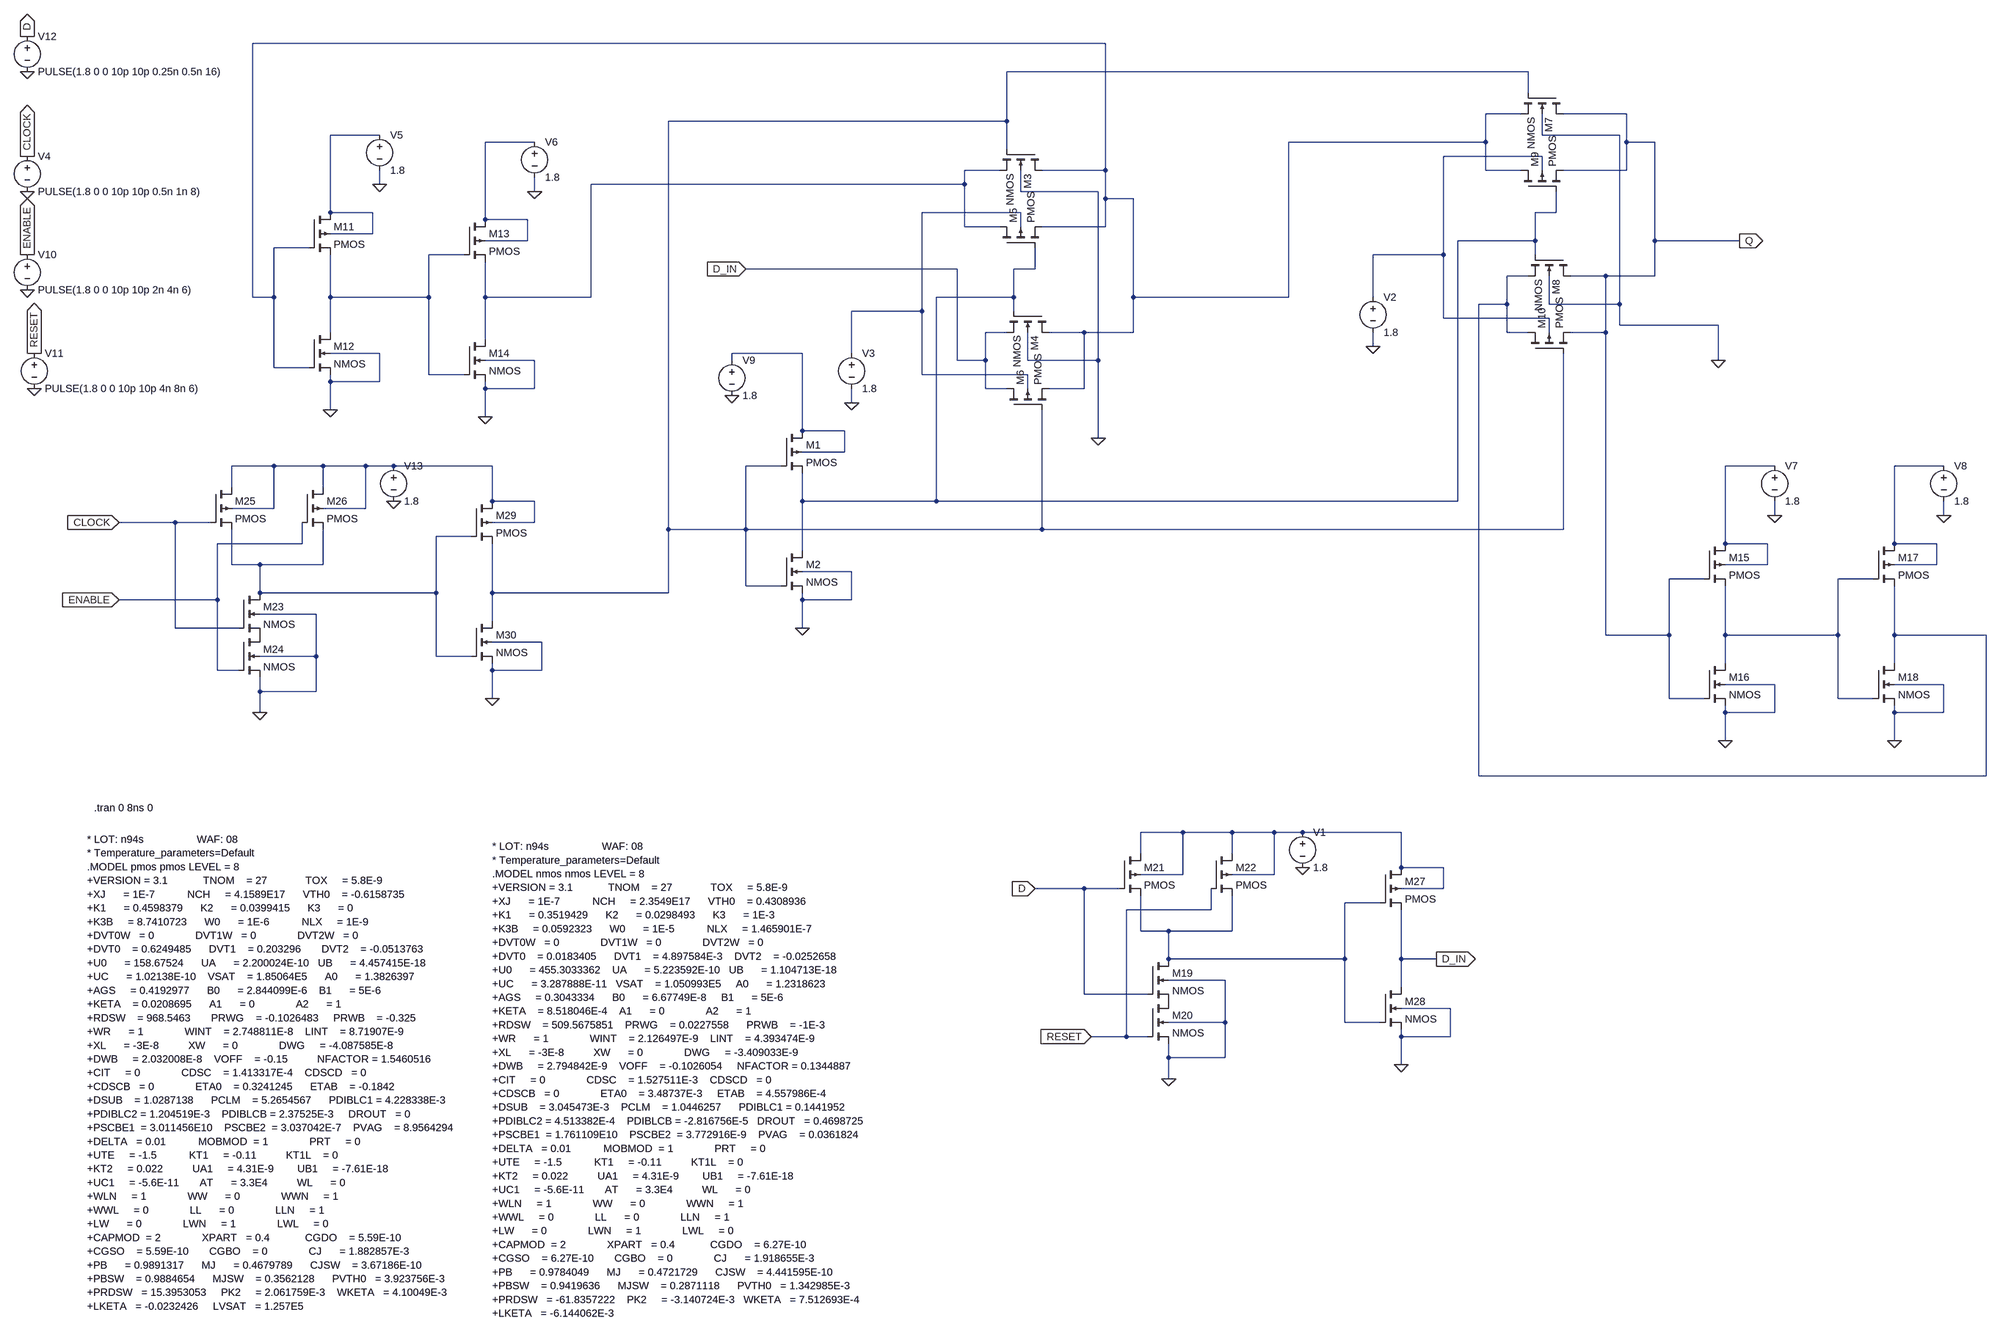
[diagram p0: schematic DFF_With_Cntrs_2.asc]
DFF_With_Cntrs_2.asc, the LTspice schematic file:
Version 4
SHEET 1 2416 1836
WIRE -240 -752 -2176 -752
WIRE 720 -688 -464 -688
WIRE 720 -640 720 -688
WIRE 704 -592 624 -592
WIRE 944 -592 800 -592
WIRE -464 -576 -464 -688
WIRE -464 -576 -1232 -576
WIRE -1888 -544 -2000 -544
WIRE 752 -544 752 -592
WIRE 928 -544 752 -544
WIRE -1536 -528 -1648 -528
WIRE 624 -528 624 -592
WIRE 624 -528 176 -528
WIRE 944 -528 944 -592
WIRE 1008 -528 944 -528
WIRE -464 -512 -464 -576
WIRE 752 -496 528 -496
WIRE -480 -464 -560 -464
WIRE -240 -464 -240 -752
WIRE -240 -464 -384 -464
WIRE 624 -464 624 -528
WIRE 704 -464 624 -464
WIRE 752 -464 752 -496
WIRE 944 -464 944 -528
WIRE 944 -464 800 -464
WIRE -1888 -432 -1888 -464
WIRE -560 -432 -560 -464
WIRE -560 -432 -1408 -432
WIRE -1536 -416 -1536 -448
WIRE -432 -416 -432 -464
WIRE -256 -416 -432 -416
WIRE -240 -400 -240 -464
WIRE -176 -400 -240 -400
WIRE -2000 -368 -2000 -544
WIRE -1904 -368 -2000 -368
WIRE -432 -368 -656 -368
WIRE 784 -368 784 -416
WIRE 784 -368 736 -368
WIRE -1648 -352 -1648 -528
WIRE -1552 -352 -1648 -352
WIRE -560 -336 -560 -432
WIRE -480 -336 -560 -336
WIRE -432 -336 -432 -368
WIRE -240 -336 -240 -400
WIRE -240 -336 -384 -336
WIRE -1904 -320 -1904 -368
WIRE -1904 -320 -2000 -320
WIRE -1552 -304 -1552 -352
WIRE -1552 -304 -1648 -304
WIRE 736 -304 736 -368
WIRE 736 -304 560 -304
WIRE 1008 -304 1008 -528
WIRE 1200 -304 1008 -304
WIRE -2048 -288 -2128 -288
WIRE -1696 -272 -1776 -272
WIRE 528 -272 528 -496
WIRE 528 -272 368 -272
WIRE 736 -272 736 -304
WIRE -576 -240 -1056 -240
WIRE -400 -240 -400 -288
WIRE -400 -240 -448 -240
WIRE 720 -224 672 -224
WIRE 896 -224 816 -224
WIRE 1008 -224 1008 -304
WIRE 1008 -224 896 -224
WIRE -2176 -176 -2176 -752
WIRE -2128 -176 -2128 -288
WIRE -2128 -176 -2176 -176
WIRE -2000 -176 -2000 -272
WIRE -1776 -176 -1776 -272
WIRE -1776 -176 -2000 -176
WIRE -1648 -176 -1648 -256
WIRE -1408 -176 -1408 -432
WIRE -1408 -176 -1648 -176
WIRE -448 -176 -448 -240
WIRE -448 -176 -624 -176
WIRE -176 -176 -176 -400
WIRE 176 -176 176 -528
WIRE 176 -176 -176 -176
WIRE 368 -176 368 -272
WIRE 672 -160 672 -224
WIRE 672 -160 608 -160
WIRE 768 -160 768 -224
WIRE 928 -160 928 -544
WIRE 928 -160 768 -160
WIRE -656 -144 -656 -368
WIRE -656 -144 -816 -144
WIRE -448 -144 -448 -176
WIRE 528 -128 528 -272
WIRE 768 -128 528 -128
WIRE 928 -112 928 -160
WIRE 1152 -112 928 -112
WIRE -2000 -96 -2000 -176
WIRE -464 -96 -512 -96
WIRE -288 -96 -368 -96
WIRE -176 -96 -176 -176
WIRE -176 -96 -288 -96
WIRE 672 -96 672 -160
WIRE 720 -96 672 -96
WIRE 768 -96 768 -128
WIRE 896 -96 896 -224
WIRE 896 -96 816 -96
WIRE -1648 -80 -1648 -176
WIRE 368 -64 368 -96
WIRE -1888 -48 -2000 -48
WIRE -928 -48 -1088 -48
WIRE -816 -48 -816 -144
WIRE -1536 -32 -1648 -32
WIRE -1088 -32 -1088 -48
WIRE -576 -32 -576 -240
WIRE -512 -32 -512 -96
WIRE -512 -32 -576 -32
WIRE -416 -32 -416 -96
WIRE -256 -32 -256 -416
WIRE -256 -32 -416 -32
WIRE 1152 -32 1152 -112
WIRE -2128 -16 -2128 -176
WIRE -2048 -16 -2128 -16
WIRE -1776 0 -1776 -176
WIRE -1696 0 -1776 0
WIRE -656 0 -656 -144
WIRE -416 0 -656 0
WIRE -2000 16 -2000 0
WIRE -1888 16 -1888 -48
WIRE -1888 16 -2000 16
WIRE -1648 32 -1648 16
WIRE -1536 32 -1536 -32
WIRE -1536 32 -1648 32
WIRE -512 32 -512 -32
WIRE -464 32 -512 32
WIRE -416 32 -416 0
WIRE -288 32 -288 -96
WIRE -288 32 -368 32
WIRE -816 64 -816 32
WIRE -2000 80 -2000 16
WIRE -1648 96 -1648 32
WIRE -928 128 -928 -48
WIRE -832 128 -928 128
WIRE -256 144 -256 -32
WIRE -832 176 -832 128
WIRE -832 176 -928 176
WIRE -2128 208 -2224 208
WIRE -2016 208 -2128 208
WIRE -1920 208 -2016 208
WIRE -1856 208 -1920 208
WIRE -1632 208 -1856 208
WIRE -976 208 -1056 208
WIRE 1280 208 1168 208
WIRE 1664 208 1552 208
WIRE -2224 256 -2224 208
WIRE -2016 256 -2016 208
WIRE -1632 288 -1632 208
WIRE -1536 288 -1632 288
WIRE -928 288 -928 224
WIRE -624 288 -624 -176
WIRE -624 288 -928 288
WIRE 560 288 560 -304
WIRE 560 288 -624 288
WIRE -2128 304 -2128 208
WIRE -2128 304 -2224 304
WIRE -1920 304 -1920 208
WIRE -1920 304 -2016 304
WIRE 1280 320 1280 288
WIRE 1664 320 1664 288
WIRE -2352 336 -2480 336
WIRE -2272 336 -2352 336
WIRE -1536 336 -1536 288
WIRE -1536 336 -1632 336
WIRE -1232 352 -1232 -576
WIRE -1056 352 -1056 208
WIRE -1056 352 -1232 352
WIRE -384 352 -384 80
WIRE -384 352 -1056 352
WIRE 800 352 800 -48
WIRE 800 352 -384 352
WIRE -1680 368 -1760 368
WIRE -2064 384 -2064 336
WIRE -2064 384 -2256 384
WIRE 1168 384 1168 208
WIRE 1264 384 1168 384
WIRE 1552 384 1552 208
WIRE 1648 384 1552 384
WIRE -928 400 -928 288
WIRE -2224 432 -2224 352
WIRE -2160 432 -2224 432
WIRE -2016 432 -2016 352
WIRE -2016 432 -2160 432
WIRE 1264 432 1264 384
WIRE 1264 432 1168 432
WIRE 1648 432 1648 384
WIRE 1648 432 1552 432
WIRE -816 448 -928 448
WIRE 1120 464 1040 464
WIRE 1504 464 1424 464
WIRE -1056 480 -1056 352
WIRE -976 480 -1056 480
WIRE -2160 496 -2160 432
WIRE -1760 496 -1760 368
WIRE -1760 496 -2160 496
WIRE -1632 496 -1632 384
WIRE -1232 496 -1232 352
WIRE -1232 496 -1632 496
WIRE -2256 512 -2256 384
WIRE -2256 512 -2480 512
WIRE -928 512 -928 496
WIRE -816 512 -816 448
WIRE -816 512 -928 512
WIRE -2032 544 -2160 544
WIRE -1632 560 -1632 496
WIRE -2352 576 -2352 336
WIRE -2208 576 -2352 576
WIRE -928 576 -928 512
WIRE 896 592 896 -96
WIRE 1040 592 1040 464
WIRE 1040 592 896 592
WIRE 1168 592 1168 480
WIRE 1424 592 1424 464
WIRE 1424 592 1168 592
WIRE 1552 592 1552 480
WIRE 1760 592 1552 592
WIRE -1520 608 -1632 608
WIRE -2032 640 -2032 544
WIRE -2032 640 -2160 640
WIRE -1760 640 -1760 496
WIRE -1680 640 -1760 640
WIRE 1168 656 1168 592
WIRE 1552 656 1552 592
WIRE -2256 672 -2256 512
WIRE -2208 672 -2256 672
WIRE -1632 672 -1632 656
WIRE -1520 672 -1520 608
WIRE -1520 672 -1632 672
WIRE 1280 704 1168 704
WIRE 1664 704 1552 704
WIRE -2160 720 -2160 688
WIRE -2032 720 -2032 640
WIRE -2032 720 -2160 720
WIRE -1632 736 -1632 672
WIRE 1040 736 1040 592
WIRE 1120 736 1040 736
WIRE 1424 736 1424 592
WIRE 1504 736 1424 736
WIRE -2160 768 -2160 720
WIRE 1168 768 1168 752
WIRE 1280 768 1280 704
WIRE 1280 768 1168 768
WIRE 1552 768 1552 752
WIRE 1664 768 1664 704
WIRE 1664 768 1552 768
WIRE 1168 832 1168 768
WIRE 1552 832 1552 768
WIRE 608 912 608 -160
WIRE 1760 912 1760 592
WIRE 1760 912 608 912
WIRE -64 1040 -160 1040
WIRE 48 1040 -64 1040
WIRE 144 1040 48 1040
WIRE 208 1040 144 1040
WIRE 432 1040 208 1040
WIRE -160 1088 -160 1040
WIRE 48 1088 48 1040
WIRE 432 1120 432 1040
WIRE 528 1120 432 1120
WIRE -64 1136 -64 1040
WIRE -64 1136 -160 1136
WIRE 144 1136 144 1040
WIRE 144 1136 48 1136
WIRE -288 1168 -400 1168
WIRE -208 1168 -288 1168
WIRE 528 1168 528 1120
WIRE 528 1168 432 1168
WIRE 384 1200 304 1200
WIRE 0 1216 0 1168
WIRE 0 1216 -192 1216
WIRE -160 1264 -160 1184
WIRE -96 1264 -160 1264
WIRE 48 1264 48 1184
WIRE 48 1264 -96 1264
WIRE -96 1328 -96 1264
WIRE 304 1328 304 1200
WIRE 304 1328 -96 1328
WIRE 432 1328 432 1216
WIRE 512 1328 432 1328
WIRE 32 1376 -96 1376
WIRE 432 1392 432 1328
WIRE -288 1408 -288 1168
WIRE -144 1408 -288 1408
WIRE 544 1440 432 1440
WIRE 32 1472 32 1376
WIRE 32 1472 -96 1472
WIRE 304 1472 304 1328
WIRE 384 1472 304 1472
WIRE -192 1504 -192 1216
WIRE -192 1504 -272 1504
WIRE -144 1504 -192 1504
WIRE 432 1504 432 1488
WIRE 544 1504 544 1440
WIRE 544 1504 432 1504
WIRE -96 1552 -96 1520
WIRE 32 1552 32 1472
WIRE 32 1552 -96 1552
WIRE 432 1568 432 1504
WIRE -96 1600 -96 1552
FLAG -928 576 0
FLAG -816 64 0
FLAG -256 144 0
FLAG 368 -64 0
FLAG 1152 -32 0
FLAG -2000 80 0
FLAG -1888 -432 0
FLAG -1648 96 0
FLAG -1536 -416 0
FLAG 1168 832 0
FLAG 1280 320 0
FLAG 1552 832 0
FLAG 1664 320 0
FLAG -1088 48 0
FLAG -1856 288 0
FLAG -2160 768 0
FLAG -2480 512 ENABLE
IOPIN -2480 512 In
FLAG -272 1504 RESET
IOPIN -272 1504 In
FLAG -2480 336 CLOCK
IOPIN -2480 336 In
FLAG 1200 -304 Q
IOPIN 1200 -304 Out
FLAG -1632 736 0
FLAG -1056 -240 D_IN
IOPIN -1056 -240 In
FLAG 512 1328 D_IN
IOPIN 512 1328 Out
FLAG -400 1168 D
IOPIN -400 1168 In
FLAG 208 1120 0
FLAG -96 1600 0
FLAG 432 1568 0
FLAG -2688 -416 0
FLAG -2688 -192 0
FLAG -2672 32 0
FLAG -2688 -496 CLOCK
IOPIN -2688 -496 Out
FLAG -2688 -272 ENABLE
IOPIN -2688 -272 Out
FLAG -2672 -48 RESET
IOPIN -2672 -48 Out
FLAG -2688 -688 0
FLAG -2688 -768 D
IOPIN -2688 -768 Out
SYMBOL nmos4 -384 -512 R90
SYMATTR InstName M3
SYMATTR Value2 l=180n w=440n
SYMBOL nmos4 -368 -144 R90
SYMATTR InstName M4
SYMATTR Value2 l=180n w=440n
SYMBOL pmos4 -976 128 R0
SYMATTR InstName M1
SYMATTR Value2 l=180n w=880n
SYMBOL nmos4 -976 400 R0
SYMATTR InstName M2
SYMATTR Value2 l=180n w=440n
SYMBOL voltage -816 -64 R0
SYMATTR InstName V3
SYMATTR Value 1.8
SYMBOL pmos4 -480 -288 R270
SYMATTR InstName M5
SYMATTR Value2 l=180n w=440n
SYMBOL pmos4 -464 80 R270
SYMATTR InstName M6
SYMATTR Value2 l=180n w=440n
SYMBOL nmos4 800 -640 R90
SYMATTR InstName M7
SYMATTR Value2 l=180n w=440n
SYMBOL nmos4 816 -272 R90
SYMATTR InstName M8
SYMATTR Value2 l=180n w=440n
SYMBOL voltage 368 -192 R0
SYMATTR InstName V2
SYMATTR Value 1.8
SYMBOL pmos4 704 -416 R270
SYMATTR InstName M9
SYMATTR Value2 l=180n w=440n
SYMBOL pmos4 720 -48 R270
SYMATTR InstName M10
SYMATTR Value2 l=180n w=440n
SYMBOL pmos4 -2048 -368 R0
SYMATTR InstName M11
SYMATTR Value2 l=180n w=880n
SYMBOL nmos4 -2048 -96 R0
SYMATTR InstName M12
SYMATTR Value2 l=180n w=440n
SYMBOL voltage -1888 -560 R0
SYMATTR InstName V5
SYMATTR Value 1.8
SYMBOL pmos4 -1696 -352 R0
SYMATTR InstName M13
SYMATTR Value2 l=180n w=880n
SYMBOL nmos4 -1696 -80 R0
SYMATTR InstName M14
SYMATTR Value2 l=180n w=440n
SYMBOL voltage -1536 -544 R0
SYMATTR InstName V6
SYMATTR Value 1.8
SYMBOL pmos4 1120 384 R0
SYMATTR InstName M15
SYMATTR Value2 l=180n w=880n
SYMBOL nmos4 1120 656 R0
SYMATTR InstName M16
SYMATTR Value2 l=180n w=440n
SYMBOL voltage 1280 192 R0
SYMATTR InstName V7
SYMATTR Value 1.8
SYMBOL pmos4 1504 384 R0
SYMATTR InstName M17
SYMATTR Value2 l=180n w=880n
SYMBOL nmos4 1504 656 R0
SYMATTR InstName M18
SYMATTR Value2 l=180n w=440n
SYMBOL voltage 1664 192 R0
SYMATTR InstName V8
SYMATTR Value 1.8
SYMBOL Voltage -1088 -48 R0
SYMATTR InstName V9
SYMATTR Value 1.8
SYMBOL nmos4 -2208 496 R0
SYMATTR InstName M23
SYMATTR Value2 l=180n w=880n
SYMBOL nmos4 -2208 592 R0
SYMATTR InstName M24
SYMATTR Value2 l=180n w=880n
SYMBOL pmos4 -2272 256 R0
SYMATTR InstName M25
SYMATTR Value2 l=180n w=880n
SYMBOL pmos4 -2064 256 R0
SYMATTR InstName M26
SYMATTR Value2 l=180n w=880n
SYMBOL Voltage -1856 192 R0
SYMATTR InstName V13
SYMATTR Value 1.8
SYMBOL pmos4 -1680 288 R0
SYMATTR InstName M29
SYMATTR Value2 l=180n w=880n
SYMBOL nmos4 -1680 560 R0
SYMATTR InstName M30
SYMATTR Value2 l=180n w=440n
SYMBOL nmos4 -144 1328 R0
SYMATTR InstName M19
SYMATTR Value2 l=180n w=880n
SYMBOL nmos4 -144 1424 R0
SYMATTR InstName M20
SYMATTR Value2 l=180n w=880n
SYMBOL pmos4 -208 1088 R0
SYMATTR InstName M21
SYMATTR Value2 l=180n w=880n
SYMBOL pmos4 0 1088 R0
SYMATTR InstName M22
SYMATTR Value2 l=180n w=880n
SYMBOL Voltage 208 1024 R0
SYMATTR InstName V1
SYMATTR Value 1.8
SYMBOL pmos4 384 1120 R0
SYMATTR InstName M27
SYMATTR Value2 l=180n w=880n
SYMBOL nmos4 384 1392 R0
SYMATTR InstName M28
SYMATTR Value2 l=180n w=440n
SYMBOL Voltage -2688 -512 R0
SYMATTR InstName V4
SYMATTR Value PULSE(1.8 0 0 10p 10p 0.5n 1n 8)
SYMBOL Voltage -2688 -288 R0
SYMATTR InstName V10
SYMATTR Value PULSE(1.8 0 0 10p 10p 2n 4n 6)
SYMBOL Voltage -2672 -64 R0
SYMATTR InstName V11
SYMATTR Value PULSE(1.8 0 0 10p 10p 4n 8n 6)
SYMBOL Voltage -2688 -784 R0
SYMATTR InstName V12
SYMATTR Value PULSE(1.8 0 0 10p 10p 0.25n 0.5n 16)
TEXT -2536 984 Left 2 !.tran 0 8ns 0
TEXT -1632 1072 Left 2 !* LOT: n94s                  WAF: 08\n* Temperature_parameters=Default\n.MODEL nmos nmos LEVEL = 8\n+VERSION = 3.1            TNOM    = 27             TOX     = 5.8E-9\n+XJ      = 1E-7           NCH     = 2.3549E17      VTH0    = 0.4308936\n+K1      = 0.3519429      K2      = 0.0298493      K3      = 1E-3\n+K3B     = 0.0592323      W0      = 1E-5           NLX     = 1.465901E-7\n+DVT0W   = 0              DVT1W   = 0              DVT2W   = 0\n+DVT0    = 0.0183405      DVT1    = 4.897584E-3    DVT2    = -0.0252658\n+U0      = 455.3033362    UA      = 5.223592E-10   UB      = 1.104713E-18\n+UC      = 3.287888E-11   VSAT    = 1.050993E5     A0      = 1.2318623\n+AGS     = 0.3043334      B0      = 6.67749E-8     B1      = 5E-6\n+KETA    = 8.518046E-4    A1      = 0              A2      = 1\n+RDSW    = 509.5675851    PRWG    = 0.0227558      PRWB    = -1E-3\n+WR      = 1              WINT    = 2.126497E-9    LINT    = 4.393474E-9\n+XL      = -3E-8          XW      = 0              DWG     = -3.409033E-9\n+DWB     = 2.794842E-9    VOFF    = -0.1026054     NFACTOR = 0.1344887\n+CIT     = 0              CDSC    = 1.527511E-3    CDSCD   = 0\n+CDSCB   = 0              ETA0    = 3.48737E-3     ETAB    = 4.557986E-4\n+DSUB    = 3.045473E-3    PCLM    = 1.0446257      PDIBLC1 = 0.1441952\n+PDIBLC2 = 4.513382E-4    PDIBLCB = -2.816756E-5   DROUT   = 0.4698725\n+PSCBE1  = 1.761109E10    PSCBE2  = 3.772916E-9    PVAG    = 0.0361824\n+DELTA   = 0.01           MOBMOD  = 1              PRT     = 0\n+UTE     = -1.5           KT1     = -0.11          KT1L    = 0\n+KT2     = 0.022          UA1     = 4.31E-9        UB1     = -7.61E-18\n+UC1     = -5.6E-11       AT      = 3.3E4          WL      = 0\n+WLN     = 1              WW      = 0              WWN     = 1\n+WWL     = 0              LL      = 0              LLN     = 1\n+LW      = 0              LWN     = 1              LWL     = 0\n+CAPMOD  = 2              XPART   = 0.4            CGDO    = 6.27E-10\n+CGSO    = 6.27E-10       CGBO    = 0              CJ      = 1.918655E-3\n+PB      = 0.9784049      MJ      = 0.4721729      CJSW    = 4.441595E-10\n+PBSW    = 0.9419636      MJSW    = 0.2871118      PVTH0   = 1.342985E-3\n+PRDSW   = -61.8357222    PK2     = -3.140724E-3   WKETA   = 7.512693E-4\n+LKETA   = -6.144062E-3
TEXT -2552 1056 Left 2 !* LOT: n94s                  WAF: 08\n* Temperature_parameters=Default\n.MODEL pmos pmos LEVEL = 8\n+VERSION = 3.1            TNOM    = 27             TOX     = 5.8E-9\n+XJ      = 1E-7           NCH     = 4.1589E17      VTH0    = -0.6158735\n+K1      = 0.4598379      K2      = 0.0399415      K3      = 0\n+K3B     = 8.7410723      W0      = 1E-6           NLX     = 1E-9\n+DVT0W   = 0              DVT1W   = 0              DVT2W   = 0\n+DVT0    = 0.6249485      DVT1    = 0.203296       DVT2    = -0.0513763\n+U0      = 158.67524      UA      = 2.200024E-10   UB      = 4.457415E-18\n+UC      = 1.02138E-10    VSAT    = 1.85064E5      A0      = 1.3826397\n+AGS     = 0.4192977      B0      = 2.844099E-6    B1      = 5E-6\n+KETA    = 0.0208695      A1      = 0              A2      = 1\n+RDSW    = 968.5463       PRWG    = -0.1026483     PRWB    = -0.325\n+WR      = 1              WINT    = 2.748811E-8    LINT    = 8.71907E-9\n+XL      = -3E-8          XW      = 0              DWG     = -4.087585E-8\n+DWB     = 2.032008E-8    VOFF    = -0.15          NFACTOR = 1.5460516\n+CIT     = 0              CDSC    = 1.413317E-4    CDSCD   = 0\n+CDSCB   = 0              ETA0    = 0.3241245      ETAB    = -0.1842\n+DSUB    = 1.0287138      PCLM    = 5.2654567      PDIBLC1 = 4.228338E-3\n+PDIBLC2 = 1.204519E-3    PDIBLCB = 2.37525E-3     DROUT   = 0\n+PSCBE1  = 3.011456E10    PSCBE2  = 3.037042E-7    PVAG    = 8.9564294\n+DELTA   = 0.01           MOBMOD  = 1              PRT     = 0\n+UTE     = -1.5           KT1     = -0.11          KT1L    = 0\n+KT2     = 0.022          UA1     = 4.31E-9        UB1     = -7.61E-18\n+UC1     = -5.6E-11       AT      = 3.3E4          WL      = 0\n+WLN     = 1              WW      = 0              WWN     = 1\n+WWL     = 0              LL      = 0              LLN     = 1\n+LW      = 0              LWN     = 1              LWL     = 0\n+CAPMOD  = 2              XPART   = 0.4            CGDO    = 5.59E-10\n+CGSO    = 5.59E-10       CGBO    = 0              CJ      = 1.882857E-3\n+PB      = 0.9891317      MJ      = 0.4679789      CJSW    = 3.67186E-10\n+PBSW    = 0.9884654      MJSW    = 0.3562128      PVTH0   = 3.923756E-3\n+PRDSW   = 15.3953053     PK2     = 2.061759E-3    WKETA   = 4.10049E-3\n+LKETA   = -0.0232426     LVSAT   = 1.257E5

The netlist it stands for:
* DFF_With_Cntrs_2.asc
M3 N001 N002 N006 0 NMOS l=180n w=440n
M4 N001 N008 D_IN 0 NMOS l=180n w=440n
M1 N011 N002 N008 N011 PMOS l=180n w=880n
M2 N008 N002 0 0 NMOS l=180n w=440n
V3 N007 0 1.8
M5 N006 N008 N001 N007 PMOS l=180n w=440n
M6 D_IN N002 N001 N007 PMOS l=180n w=440n
M7 Q N002 N001 0 NMOS l=180n w=440n
M8 Q N008 N010 0 NMOS l=180n w=440n
V2 N005 0 1.8
M9 N001 N008 Q N005 PMOS l=180n w=440n
M10 N010 N002 Q N005 PMOS l=180n w=440n
M11 N003 N001 N009 N003 PMOS l=180n w=880n
M12 N009 N001 0 0 NMOS l=180n w=440n
V5 N003 0 1.8
M13 N004 N009 N006 N004 PMOS l=180n w=880n
M14 N006 N009 0 0 NMOS l=180n w=440n
V6 N004 0 1.8
M15 N013 Q N016 N013 PMOS l=180n w=880n
M16 N016 Q 0 0 NMOS l=180n w=440n
V7 N013 0 1.8
M17 N014 N016 N010 N014 PMOS l=180n w=880n
M18 N010 N016 0 0 NMOS l=180n w=440n
V8 N014 0 1.8
V9 N011 0 1.8
M23 N015 CLOCK P001 0 NMOS l=180n w=880n
M24 P001 ENABLE 0 0 NMOS l=180n w=880n
M25 N012 CLOCK N015 N012 PMOS l=180n w=880n
M26 N012 ENABLE N015 N012 PMOS l=180n w=880n
V13 N012 0 1.8
M29 N012 N015 N002 N012 PMOS l=180n w=880n
M30 N002 N015 0 0 NMOS l=180n w=440n
M19 N018 D P002 0 NMOS l=180n w=880n
M20 P002 RESET 0 0 NMOS l=180n w=880n
M21 N017 D N018 N017 PMOS l=180n w=880n
M22 N017 RESET N018 N017 PMOS l=180n w=880n
V1 N017 0 1.8
M27 N017 N018 D_IN N017 PMOS l=180n w=880n
M28 D_IN N018 0 0 NMOS l=180n w=440n
V4 CLOCK 0 PULSE(1.8 0 0 10p 10p 0.5n 1n 8)
V10 ENABLE 0 PULSE(1.8 0 0 10p 10p 2n 4n 6)
V11 RESET 0 PULSE(1.8 0 0 10p 10p 4n 8n 6)
V12 D 0 PULSE(1.8 0 0 10p 10p 0.25n 0.5n 16)
.model NMOS NMOS
.model PMOS PMOS
.lib standard.mos
.tran 0 8ns 0
* LOT: n94s                  WAF: 08
* Temperature_parameters=Default
.MODEL nmos nmos LEVEL = 8
+VERSION = 3.1            TNOM    = 27             TOX     = 5.8E-9
+XJ      = 1E-7           NCH     = 2.3549E17      VTH0    = 0.4308936
+K1      = 0.3519429      K2      = 0.0298493      K3      = 1E-3
+K3B     = 0.0592323      W0      = 1E-5           NLX     = 1.465901E-7
+DVT0W   = 0              DVT1W   = 0              DVT2W   = 0
+DVT0    = 0.0183405      DVT1    = 4.897584E-3    DVT2    = -0.0252658
+U0      = 455.3033362    UA      = 5.223592E-10   UB      = 1.104713E-18
+UC      = 3.287888E-11   VSAT    = 1.050993E5     A0      = 1.2318623
+AGS     = 0.3043334      B0      = 6.67749E-8     B1      = 5E-6
+KETA    = 8.518046E-4    A1      = 0              A2      = 1
+RDSW    = 509.5675851    PRWG    = 0.0227558      PRWB    = -1E-3
+WR      = 1              WINT    = 2.126497E-9    LINT    = 4.393474E-9
+XL      = -3E-8          XW      = 0              DWG     = -3.409033E-9
+DWB     = 2.794842E-9    VOFF    = -0.1026054     NFACTOR = 0.1344887
+CIT     = 0              CDSC    = 1.527511E-3    CDSCD   = 0
+CDSCB   = 0              ETA0    = 3.48737E-3     ETAB    = 4.557986E-4
+DSUB    = 3.045473E-3    PCLM    = 1.0446257      PDIBLC1 = 0.1441952
+PDIBLC2 = 4.513382E-4    PDIBLCB = -2.816756E-5   DROUT   = 0.4698725
+PSCBE1  = 1.761109E10    PSCBE2  = 3.772916E-9    PVAG    = 0.0361824
+DELTA   = 0.01           MOBMOD  = 1              PRT     = 0
+UTE     = -1.5           KT1     = -0.11          KT1L    = 0
+KT2     = 0.022          UA1     = 4.31E-9        UB1     = -7.61E-18
+UC1     = -5.6E-11       AT      = 3.3E4          WL      = 0
+WLN     = 1              WW      = 0              WWN     = 1
+WWL     = 0              LL      = 0              LLN     = 1
+LW      = 0              LWN     = 1              LWL     = 0
+CAPMOD  = 2              XPART   = 0.4            CGDO    = 6.27E-10
+CGSO    = 6.27E-10       CGBO    = 0              CJ      = 1.918655E-3
+PB      = 0.9784049      MJ      = 0.4721729      CJSW    = 4.441595E-10
+PBSW    = 0.9419636      MJSW    = 0.2871118      PVTH0   = 1.342985E-3
+PRDSW   = -61.8357222    PK2     = -3.140724E-3   WKETA   = 7.512693E-4
+LKETA   = -6.144062E-3
* LOT: n94s                  WAF: 08
* Temperature_parameters=Default
.MODEL pmos pmos LEVEL = 8
+VERSION = 3.1            TNOM    = 27             TOX     = 5.8E-9
+XJ      = 1E-7           NCH     = 4.1589E17      VTH0    = -0.6158735
+K1      = 0.4598379      K2      = 0.0399415      K3      = 0
+K3B     = 8.7410723      W0      = 1E-6           NLX     = 1E-9
+DVT0W   = 0              DVT1W   = 0              DVT2W   = 0
+DVT0    = 0.6249485      DVT1    = 0.203296       DVT2    = -0.0513763
+U0      = 158.67524      UA      = 2.200024E-10   UB      = 4.457415E-18
+UC      = 1.02138E-10    VSAT    = 1.85064E5      A0      = 1.3826397
+AGS     = 0.4192977      B0      = 2.844099E-6    B1      = 5E-6
+KETA    = 0.0208695      A1      = 0              A2      = 1
+RDSW    = 968.5463       PRWG    = -0.1026483     PRWB    = -0.325
+WR      = 1              WINT    = 2.748811E-8    LINT    = 8.71907E-9
+XL      = -3E-8          XW      = 0              DWG     = -4.087585E-8
+DWB     = 2.032008E-8    VOFF    = -0.15          NFACTOR = 1.5460516
+CIT     = 0              CDSC    = 1.413317E-4    CDSCD   = 0
+CDSCB   = 0              ETA0    = 0.3241245      ETAB    = -0.1842
+DSUB    = 1.0287138      PCLM    = 5.2654567      PDIBLC1 = 4.228338E-3
+PDIBLC2 = 1.204519E-3    PDIBLCB = 2.37525E-3     DROUT   = 0
+PSCBE1  = 3.011456E10    PSCBE2  = 3.037042E-7    PVAG    = 8.9564294
+DELTA   = 0.01           MOBMOD  = 1              PRT     = 0
+UTE     = -1.5           KT1     = -0.11          KT1L    = 0
+KT2     = 0.022          UA1     = 4.31E-9        UB1     = -7.61E-18
+UC1     = -5.6E-11       AT      = 3.3E4          WL      = 0
+WLN     = 1              WW      = 0              WWN     = 1
+WWL     = 0              LL      = 0              LLN     = 1
+LW      = 0              LWN     = 1              LWL     = 0
+CAPMOD  = 2              XPART   = 0.4            CGDO    = 5.59E-10
+CGSO    = 5.59E-10       CGBO    = 0              CJ      = 1.882857E-3
+PB      = 0.9891317      MJ      = 0.4679789      CJSW    = 3.67186E-10
+PBSW    = 0.9884654      MJSW    = 0.3562128      PVTH0   = 3.923756E-3
+PRDSW   = 15.3953053     PK2     = 2.061759E-3    WKETA   = 4.10049E-3
+LKETA   = -0.0232426     LVSAT   = 1.257E5
.backanno
.end